# Altium project PWM_Controller_Half_Bridge_ONLY_TL494.PrjPCB
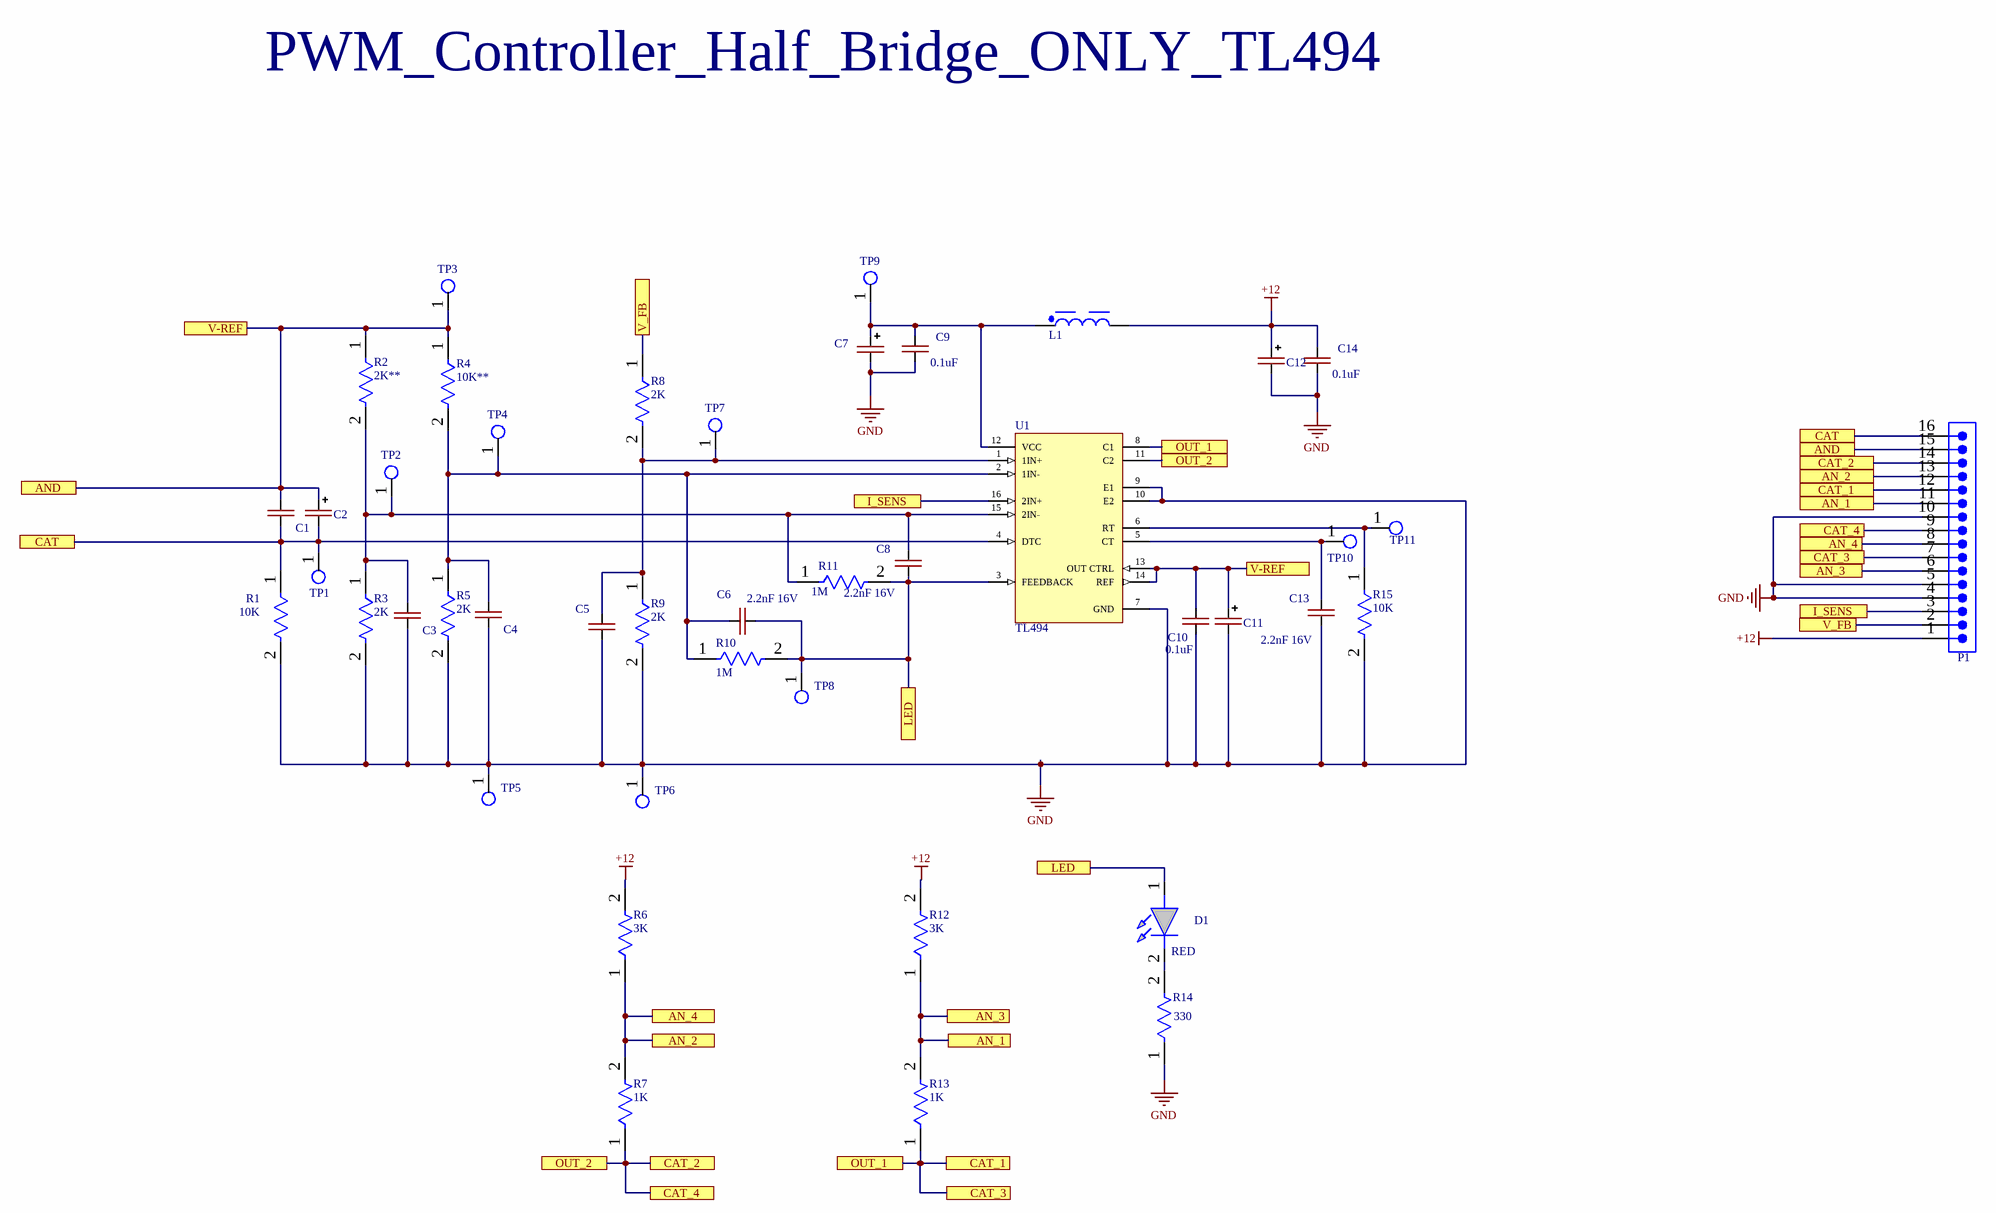
[diagram p0: PWM_Controller_Half_Bridge_ONLY_TL494.SchDoc]
1 sheet, 44 parts. Net scope: flat (ports and power ports of the same name join across sheets).
Board file: PWM_Controller_Half_Bridge_ONLY_TL494.PcbDoc

## Sheet PWM_Controller_Half_Bridge_ONLY_TL494.SchDoc
size A1; SPICEModelCacheYQEDCYZF: <root> / <DocumentId>YQEDCYZF</DocumentId> / <CacheFrame Number="0"> / <Model Name="7850_744775147_47u" Kind="CKT"> / <Text>******* / .subckt 7850_744775147_47u 1 2 / Rp 1 2 40000 / Cp 1 2 4p / Rs 1 N3 0.1343 / L1 N3 2 47u / .ends 7850_744775147_47u</Text> / </Model> / </CacheFrame> / </root>

### Parts
C1  CAP-NON-POLAR  [CAP-0805]  (value not drawn)
C2  CAP-POLAR  [CAP-TAN-D]  (value not drawn)
C3  CAP-NON-POLAR  [CAP-0805]  (value not drawn)
C4  CAP-NON-POLAR  [CAP-0805]  (value not drawn)
C5  CAP-NON-POLAR  [CAP-0805]  (value not drawn)
C6  2.2nF 16V  [CAP-0805]
C7  CAP-POLAR  [CAP_SMD_Size_E]  (value not drawn)
C8  2.2nF 16V  [CAP-0805]
C9  0.1uF  [CAP-0805]
C10  0.1uF  [CAP-0805]
C11  CAP-POLAR  [CAP-TAN-D]  (value not drawn)
C12  CAP-POLAR  [CAP_SMD_Size_E]  (value not drawn)
C13  2.2nF 16V  [CAP-0805]
C14  0.1uF  [CAP-0805]
D1  RED  [LED_RED]
L1  47µH, 1.17A  [WE-PD2_7850]  (value not drawn)
P1  61301611021  [61301611021]  (value not drawn)
R1  10K  [RES-0805]
R2  2K**  [RES-0805]
R3  2K  [RES-0805]
R4  10K**  [RES-0805]
R5  2K  [RES-0805]
R6  3K  [RES-0805]
R7  1K  [RES-0805]
R8  2K  [RES-0805]
R9  2K  [RES-0805]
R10  1M  [RES-0805]
R11  1M  [RES-0805]
R12  3K  [RES-0805]
R13  1K  [RES-0805]
R14  330  [RES-0805]
R15  10K  [RES-0805]
TP1  (no value)  [Test_Point]
TP2  (no value)  [Test_Point]
TP3  (no value)  [Test_Point]
TP4  (no value)  [Test_Point]
TP5  (no value)  [Test_Point]
TP6  (no value)  [Test_Point]
TP7  (no value)  [Test_Point]
TP8  (no value)  [Test_Point]
TP9  (no value)  [Test_Point]
TP10  (no value)  [Test_Point]
TP11  (no value)  [Test_Point]
U1  TL494  [SOIC-16-M]

### Ports
AN_1, AN_2, AN_3, AN_4, AND, CAT, CAT_1, CAT_2, CAT_3, CAT_4, I_SENS, LED, OUT_1, OUT_2, V-REF, V_FB

### Nets
+12: C12.1(+) C14.2 L1.2 P1.1 R6.2 R12.2
GND: C3.1 C4.1 C5.1 C7.2(-) C9.1 C10.1 C11.2(-) C12.2(-) C13.1 C14.1 P1.4 P1.5 P1.10 R1.2 R3.2 R5.2 R9.2 R14.1 R15.2 TP5.1(G9) TP6.1(G9) U1.7(GND) U1.9(E1) U1.10(E2)
NetC1_1: C1.1 C2.2(-) P1.16 R1.1 TP1.1(G9) U1.4(DTC) ; port CAT
NetC1_2: C1.2 C2.1(+) C10.2 C11.1(+) P1.15 R2.1 R4.1 TP3.1(G9) U1.13(OUT_CTRL) U1.14(REF) ; port V-REF, port AND
NetC3_2: C3.2 C8.2 R2.2 R3.1 R11.1 TP2.1(G9) U1.15(2IN-)
NetC4_2: C4.2 C6.2 R4.2 R5.1 R10.1 TP4.1(G9) U1.2(1IN-)
NetC5_2: C5.2 R8.2 R9.1 TP7.1(G9) U1.1(1IN+)
NetC6_1: C6.1 C8.1 D1.1(A) R10.2 R11.2 TP8.1(G9) U1.3(FEEDBACK) ; port LED
NetC7_1: C7.1(+) C9.2 L1.1 TP9.1(G9) U1.12(VCC)
NetC13_2: C13.2 TP10.1(G9) U1.5(CT)
NetD1_2: D1.2(K) R14.2
NetP1_2: P1.2 R8.1 ; port V_FB
NetP1_3: P1.3 U1.16(2IN+) ; port I_SENS
NetP1_6: P1.6 P1.11 R12.1 R13.2 ; port AN_1, port AN_3
NetP1_7: P1.7 P1.12 R13.1 U1.8(C1) ; port OUT_1, port CAT_1, port CAT_3
NetP1_8: P1.8 P1.13 R6.1 R7.2 ; port AN_2, port AN_4
NetP1_9: P1.9 P1.14 R7.1 U1.11(C2) ; port OUT_2, port CAT_2, port CAT_4
NetR15_1: R15.1 TP11.1(G9) U1.6(RT)

### Notes on the sheet
- PWM_Controller_Half_Bridge_ONLY_TL494

### Library data of the parts
C6 C8-C10 C13 C14 = CAP-NON-POLAR
D1 = LED: WURTH ELEKTRONIK - 151031YS06000 - LED, Yellow, Through Hole, T-1 (3mm), 30 mA, 2 V, 590 nm; Geometry.Height: 5.5mm; Manufacturer_Name: Wurth Elektronik; Manufacturer_Part_Number: 151031YS06000; Mouser Part Number: 710-151031YS06000; Mouser Price/Stock: https://www.mouser.co.uk/ProductDetail/Wurth-Elektronik/151031YS06000?qs=LlUlMxKIyB3xSYYW%252BcuBiQ%3D%3D; Arrow Part Number: *; Arrow Price/Stock: *; Mouser Testing Part Number: *; Mouser Testing Price/Stock: *; Datasheet Link: https://katalog.we-online.de/led/datasheet/151031YS06000.pdf
L1 = 744775147: WE-PD2 SMT Power Inductor, size 7850, 47µH, 1.17A, 0.18Ω; Manufacturer: Wurth Elektronik; Case/Size Code: 7850; DC Resistance: 0.134Ω; Saturation Current: 1.24A; Self Resonant Frequency: 12MHz; Manufacturer Part Number: 744775147; Category: Unshielded Power Inductors; Match Code: WE-PD2; ComponentLink1Description: Website Link; ComponentLink1URL: https://www.we-online.com/redexpert/article/744775147?ad; ComponentLink2Description: Datasheet Link; ComponentLink2URL: https://www.we-online.com/redexpert/spec/744775147?ad; Mount: Surface Mount; Operating Temperature Max: 125°C; Operating Temperature Min: -40°C; Packaging: Tape and Reel; Length: 7.8mm; Width: 7mm; Height: 4.95mm; DC Resistance Max: 0.18Ω; Inductance: 47µH; Rated Current: 1.17A
P1 = 61301611021: WR-PHD Pin Header, THT, Angled, pitch 2.54mm, 1 Row, 16P; Manufacturer: Wurth Elektronik; Contact Resistance: 20mΩ; Rated Current: 3A; Working Voltage: 250V; Withstanding Voltage: 500V; ComponentLink1Description: Website Link; ComponentLink1URL: https://www.we-online.com/redexpert/article/61301611021?ad; ComponentLink2Description: Datasheet Link; ComponentLink2URL: https://www.we-online.com/redexpert/spec/61301611021?ad; Manufacturer Part Number: 61301611021; Category: Board-to-Board Connectors; Match Code: WR-PHD; Mount: Through Hole; Operating Temperature Max: 105°C; Operating Temperature Min: -40°C; Packaging: Bag; Gender: Pin Header; Number of Pins: 16; Number of Rows: 1; Orientation: Angled; Pitch: 2.54mm
R1 R3 R5-R15 = RES-CONST
R2 = RES-CONST: 2K
R4 = RES-CONST: 10K
TP1-TP11 = TP_PCB?: Test_Point
U1 = TL494: TL494 Pwm controller